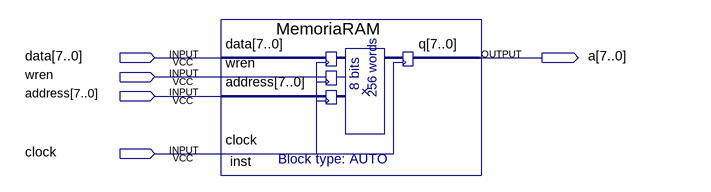
[diagram p0: schematic sheet]
// Quartus schematic MemoriaRAMM.bdf as structural Verilog: 1 symbols, 5 pins
module MemoriaRAMM (
  input  [7:0] data,
  input  wren,
  input  [7:0] address,
  input  clock,
  output [7:0] a
);

  MemoriaRAM inst (.data(data), .wren(wren), .address(address), .clock(clock), .q(a));
endmodule
